# Altium schematic sheet Sheet1.SchDoc
size A4
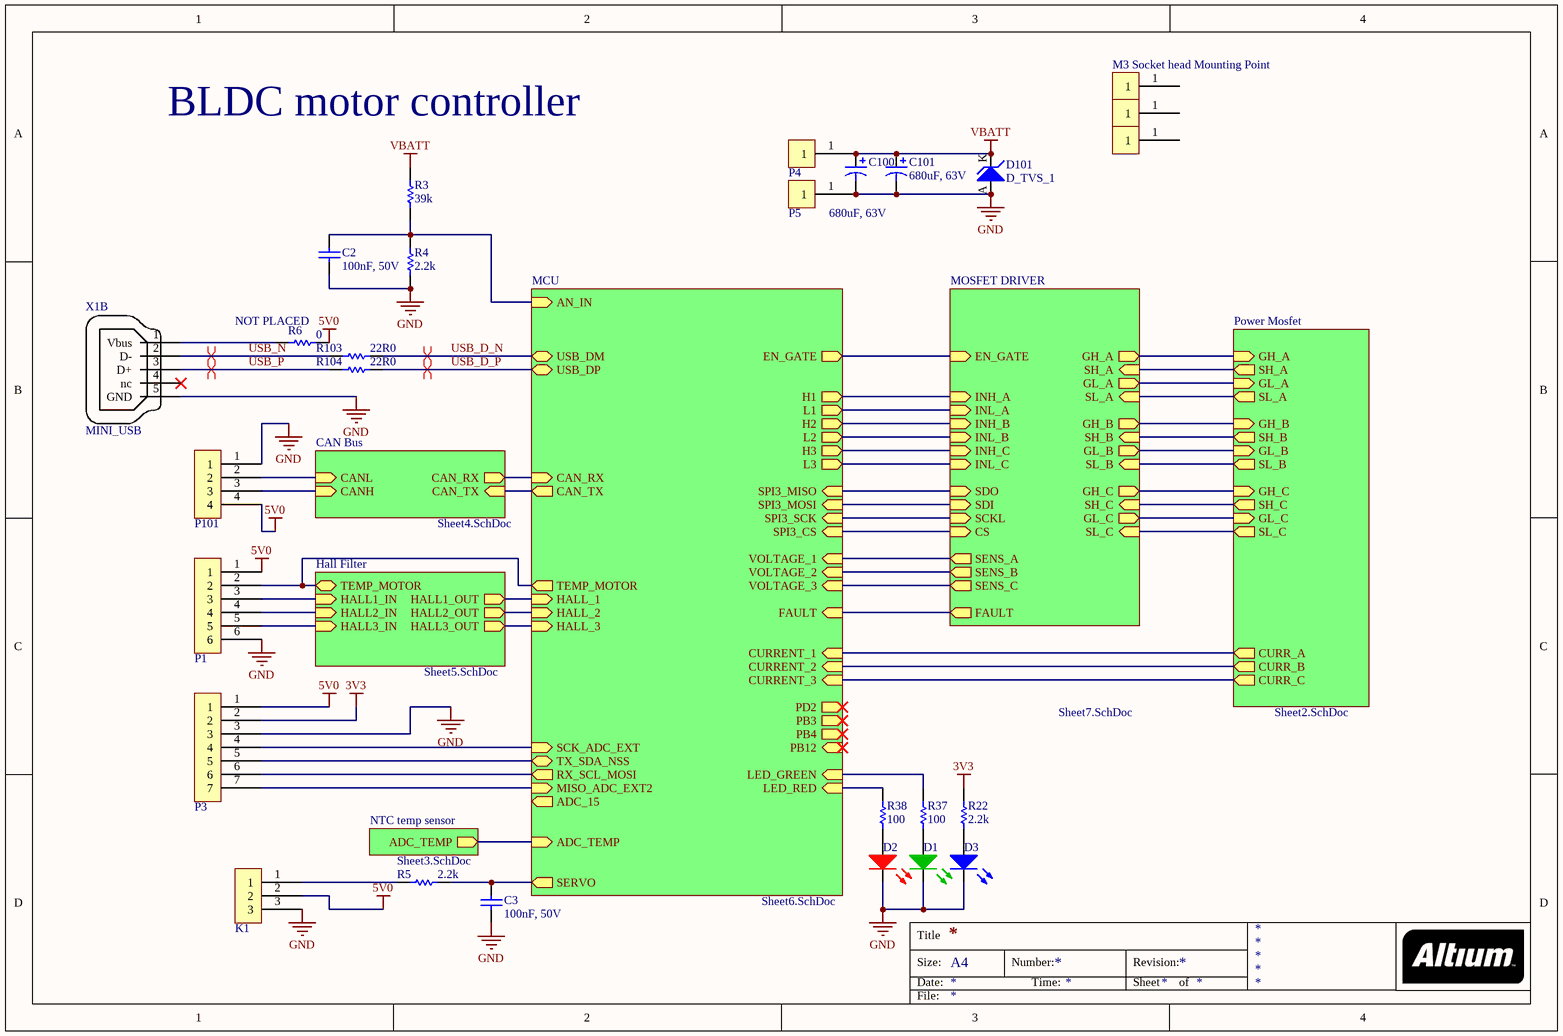
[diagram p0: Sheet1.SchDoc]

## Parts
C2  value 100nF, 50V  [SMD-0603 Capacitor]  (hidden comment: Voltage important)
C3  value 100nF, 50V  [SMD-0603 Capacitor]  (hidden comment: Voltage important)
C100  value 680uF, 63V  [ALU CAP 16DIA 25HIGH]  (hidden comment: CAP_POL)
C101  value 680uF, 63V  [ALU CAP 16DIA 25HIGH]  (hidden comment: CAP_POL)
D1  LED_GREEN  [SMD-0603 LED GREEN]  (value not drawn)
D2  LED_RED  [SMD-0603 LED RED]  (value not drawn)
D3  LED_BLUE  [SMD-0603 LED BLUE]  (value not drawn)
D101  D_TVS_1  [SMC-403-03]
K1  -  [HEADER 3 PIN]  (value not drawn)
M1  M3 Socket head Mounting Point  [M3 Socket head]
M2  M3 Socket head Mounting Point  [M3 Socket head]  (value not drawn)
M3  M3 Socket head Mounting Point  [M3 Socket head]  (value not drawn)
P1  B6B-PH-K-S(LF)(SN)  [JST PH TH VERT 6]  (value not drawn)
P3  B7B-PH-K-S(LF)(SN)  [JST PH TH VERT 7]  (value not drawn)
P4  -  [PAD1]  (value not drawn)
P5  -  [PAD1]  (value not drawn)
P101  B4B-PH-K-S(LF)(SN)  [JST PH TH VERT 4]  (value not drawn)
R3  39k  [SMD-0603 Resistor]
R4  2.2k  [SMD-0603 Resistor]
R5  2.2k  [SMD-0603 Resistor]
R6  0  Place (YES/NO): NOT PLACED  [SMD-0603 Resistor]
R22  2.2k  [SMD-0603 Resistor]
R37  100  [SMD-0603 Resistor]
R38  100  [SMD-0603 Resistor]
R103  22R0  [SMD-0603 Resistor]
R104  22R0  [SMD-0603 Resistor]
X1B  MINI_USB  [USB-MICRO B RA SMT-TH]

## Sub-sheets
CAN Bus = Sheet4.SchDoc: CANH (in), CANL (in), CAN_RX (out), CAN_TX (in)
Hall Filter = Sheet5.SchDoc: HALL3_IN (in), HALL2_IN (in), HALL1_IN (in), HALL3_OUT (out), HALL2_OUT (out), HALL1_OUT (out), TEMP_MOTOR
MCU = Sheet6.SchDoc: ADC_TEMP (in), SCK_ADC_EXT (in), MISO_ADC_EXT2 (in), H3 (out), H2 (out), H1 (out), USB_DM (bidir), USB_DP (bidir), SERVO (out), HALL_1 (in), HALL_2 (in), CAN_RX (in), CAN_TX (out), L1 (out), L2 (out), L3 (out), AN_IN (in), TX_SDA_NSS (bidir), RX_SCL_MOSI (out), EN_GATE (out), HALL_3 (in), FAULT (in), VOLTAGE_2 (in), VOLTAGE_1 (in), TEMP_MOTOR (out), CURRENT_1 (in), PB12 (in), SPI3_MOSI (in), ADC_15 (out), VOLTAGE_3 (in), LED_RED (in), LED_GREEN (in), CURRENT_2 (in), PB4 (out), PB3 (out), SPI3_SCK (in), CURRENT_3 (in), SPI3_CS (in), SPI3_MISO (in), PD2 (out)
MOSFET DRIVER = Sheet7.SchDoc: FAULT (out), EN_GATE (in), GH_A (out), SH_A (in), GL_A (out), SL_A (in), GH_B (out), SH_B (in), GL_B (out), SL_B (in), GH_C (out), SH_C (in), GL_C (out), SL_C (in), SENS_C (out), CS (in), SDI (in), SENS_A (out), SENS_B (out), SDO (in), SCKL (in), INH_A (in), INL_A (in), INH_B (in), INL_B (in), INH_C (in), INL_C (in)
NTC temp sensor = Sheet3.SchDoc: ADC_TEMP (out)
Power Mosfet = Sheet2.SchDoc: SH_A (out), GH_A (in), GL_A (in), SL_A (out), SH_B (out), GH_B (in), GL_B (in), SL_B (out), SH_C (out), GH_C (in), GL_C (in), SL_C (out), CURR_A (out), CURR_B (out), CURR_C (out)

## Nets
3V3: P3.2 R22.2
5V0: K1.2 P1.1 P3.1 P101.4 R6.2
GND: C2.2 C3.1 C100.2 C101.2 D1.2 D2.2 D3.2 D101.A K1.3 P1.6 P3.3 P5.1 P101.1 R4.1 X1B.5(GND)
VBATT: C100.1 C101.1 D101.K P4.1 R3.2
USB_D_N: R103.2 ; sheet MCU/USB_DM
USB_D_P: R104.2 ; sheet MCU/USB_DP
USB_N: R103.1 X1B.2(D-)
USB_P: R104.1 X1B.3(D+)
NetC2_1: C2.1 R3.1 R4.2 ; sheet MCU/AN_IN
NetC3_2: C3.2 R5.2 ; sheet MCU/SERVO
NetD1_1: D1.1 R37.1
NetD2_1: D2.1 R38.1
NetD3_1: D3.1 R22.1
NetK1_1: K1.1 R5.1
NetP1_2: P1.2 ; sheet MCU/TEMP_MOTOR, sheet Hall Filter/TEMP_MOTOR
NetP1_3: P1.3 ; sheet Hall Filter/HALL1_IN
NetP1_4: P1.4 ; sheet Hall Filter/HALL2_IN
NetP1_5: P1.5 ; sheet Hall Filter/HALL3_IN
NetP3_4: P3.4 ; sheet MCU/SCK_ADC_EXT
NetP3_5: P3.5 ; sheet MCU/TX_SDA_NSS
NetP3_6: P3.6 ; sheet MCU/RX_SCL_MOSI
NetP3_7: P3.7 ; sheet MCU/MISO_ADC_EXT2
NetP101_2: P101.2 ; sheet CAN Bus/CANL
NetP101_3: P101.3 ; sheet CAN Bus/CANH
NetR6_1: R6.1 X1B.1(Vbus)
NetR37_2: R37.2 ; sheet MCU/LED_GREEN
NetR38_2: R38.2 ; sheet MCU/LED_RED
(unnamed): sheet MOSFET DRIVER/FAULT, sheet MCU/FAULT
(unnamed): sheet MOSFET DRIVER/EN_GATE, sheet MCU/EN_GATE
(unnamed): sheet MOSFET DRIVER/GH_A, sheet Power Mosfet/GH_A
(unnamed): sheet MOSFET DRIVER/SH_A, sheet Power Mosfet/SH_A
(unnamed): sheet MOSFET DRIVER/GL_A, sheet Power Mosfet/GL_A
(unnamed): sheet MOSFET DRIVER/SL_A, sheet Power Mosfet/SL_A
(unnamed): sheet MOSFET DRIVER/GH_B, sheet Power Mosfet/GH_B
(unnamed): sheet MOSFET DRIVER/SH_B, sheet Power Mosfet/SH_B
(unnamed): sheet MOSFET DRIVER/GL_B, sheet Power Mosfet/GL_B
(unnamed): sheet MOSFET DRIVER/SL_B, sheet Power Mosfet/SL_B
(unnamed): sheet MOSFET DRIVER/GH_C, sheet Power Mosfet/GH_C
(unnamed): sheet MOSFET DRIVER/SH_C, sheet Power Mosfet/SH_C
(unnamed): sheet MOSFET DRIVER/GL_C, sheet Power Mosfet/GL_C
(unnamed): sheet MOSFET DRIVER/SL_C, sheet Power Mosfet/SL_C
(unnamed): sheet MOSFET DRIVER/SENS_C, sheet MCU/VOLTAGE_3
(unnamed): sheet MOSFET DRIVER/CS, sheet MCU/SPI3_CS
(unnamed): sheet MOSFET DRIVER/SDI, sheet MCU/SPI3_MOSI
(unnamed): sheet MOSFET DRIVER/SENS_A, sheet MCU/VOLTAGE_1
(unnamed): sheet MOSFET DRIVER/SENS_B, sheet MCU/VOLTAGE_2
(unnamed): sheet MOSFET DRIVER/SDO, sheet MCU/SPI3_MISO
(unnamed): sheet MOSFET DRIVER/SCKL, sheet MCU/SPI3_SCK
(unnamed): sheet MOSFET DRIVER/INH_A, sheet MCU/H1
(unnamed): sheet MOSFET DRIVER/INL_A, sheet MCU/L1
(unnamed): sheet MOSFET DRIVER/INH_B, sheet MCU/H2
(unnamed): sheet MOSFET DRIVER/INL_B, sheet MCU/L2
(unnamed): sheet MOSFET DRIVER/INH_C, sheet MCU/H3
(unnamed): sheet MOSFET DRIVER/INL_C, sheet MCU/L3
(unnamed): sheet Power Mosfet/CURR_A, sheet MCU/CURRENT_1
(unnamed): sheet Power Mosfet/CURR_B, sheet MCU/CURRENT_2
(unnamed): sheet Power Mosfet/CURR_C, sheet MCU/CURRENT_3
(unnamed): sheet MCU/ADC_TEMP, sheet NTC temp sensor/ADC_TEMP
(unnamed): sheet MCU/HALL_1, sheet Hall Filter/HALL1_OUT
(unnamed): sheet MCU/HALL_2, sheet Hall Filter/HALL2_OUT
(unnamed): sheet MCU/CAN_RX, sheet CAN Bus/CAN_RX
(unnamed): sheet MCU/CAN_TX, sheet CAN Bus/CAN_TX
(unnamed): sheet MCU/HALL_3, sheet Hall Filter/HALL3_OUT

Not connected (* = marked no-connect by the designer): M1 1; M2 1; M3 1; X1B 4(nc)*

## Layout directives
differential pair: USB_D_N, USB_D_P, USB_N, USB_P

## Notes on the sheet
- BLDC motor controller
- Title
- Size:
- Date:
- A4
- Number:
- Time:
- Revision:
- Sheet
- of
- File:

## Library data of the parts
C2 C3 = 7: CAP 100n, 50V, 0603; Manufacturer Part Number: 06035C104JAT2A; Manufacturer: AVX Corporation; ID: 7; Place (YES/NO): YES
C100 C101 = 21: 680µF 63V Aluminum Capacitors Radial; Manufacturer Part Number: UPW1J681MHD; Manufacturer: Nichicon; ID: 21; Place (YES/NO): YES
D1 = 1: LED Green, 0603; Part Number: LTST-C191KGKT; Manufacturer: Lite-On Inc.; ID: 1; Place (YES/NO): YES; Manufacturer Part Number: LTST-C191KGKT
D2 = 2: LED Red, 0603; Part Number: LTST-C191KRKT; Manufacturer: Lite-On Inc.; ID: 2; Place (YES/NO): YES; Manufacturer Part Number: LTST-C191KRKT
D3 = 3: LED Blue, 0603; Part Number: LBQ39GN1P1351; Manufacturer: OSRAM; ID: 3; Place (YES/NO): YES; Manufacturer Part Number: LBQ39GN1P1351
D101 = 16: TVS DIODE 51VWM 82.4VC SMC; Manufacturer Part Number: SMCJ51A; Manufacturer: ON Semiconductor; ID: 16; Value: 51V; Place (YES/NO): YES
K1 = 6: Breakaway 3 pin Through hole; ID: 6; Place (YES/NO): YES; Manufacturer Part Number: -; Manufacturer: -
M1-M3 = 1: ID: 1; Place (YES/NO): yes; Value: M3
P1 = 3: JST PH Through hole Vertical 6 Pin; ID: 3; Value: JST PH 6 PIN; Place (YES/NO): YES; Manufacturer Part Number: B6B-PH-K-S(LF)(SN); Manufacturer: JST
P3 = 4: JST PH Through hole Vertical 7 Pin; ID: 4; Value: JST PH 4 PIN; Place (YES/NO): YES; Manufacturer Part Number: B7B-PH-K-S(LF)(SN); Manufacturer: JST
P4 P5 = 1: SMD Power landing; ID: 1; Value: -; Place (YES/NO): -; Manufacturer Part Number: -; Manufacturer: -
P101 = 2: JST PH Through hole Vertical 4 Pin; ID: 2; Value: JST PH 4 PIN; Place (YES/NO): YES; Manufacturer Part Number: B4B-PH-K-S(LF)(SN); Manufacturer: JST
R3 = 8: R 39k, 0603; Manufacturer Part Number: ERJ-3EKF3902V; Manufacturer: Panasonic Electronic Components; ID: 8; Place (YES/NO): YES; Value: 39k
R4 R5 R22 = 3: R 2.2k, 0603; Manufacturer Part Number: RK73H1JTTD2201F; Manufacturer: KOA Speer; ID: 3; Place (YES/NO): YES; Value: 2.2k
R6 = 16: R 0 ohm, 0603; Manufacturer: KOA Speer; ID: 16; Value: 0
R37 R38 = 2: R 100ohm, 0603; Manufacturer Part Number: RK73H1JTTD1000F; Manufacturer: KOA Speer; ID: 2; Place (YES/NO): YES; Value: 100
R103 R104 = 12: R 22R, 0603; Manufacturer Part Number: RK73H1JTTD22R0F; Manufacturer: KOA Speer; ID: 12; Place (YES/NO): YES; Value: 22R0
X1B = 39: CONN USB MICRO B RECPT SMT R/A TH; Manufacturer Part Number: 10118194-0001LF; Manufacturer: Amphenol FCI; ID: 39; Value: Micro-USB; Place (YES/NO): YES